# EAGLE design breakout (EAGLE 7.7.0)

## Sheet 1 of 2
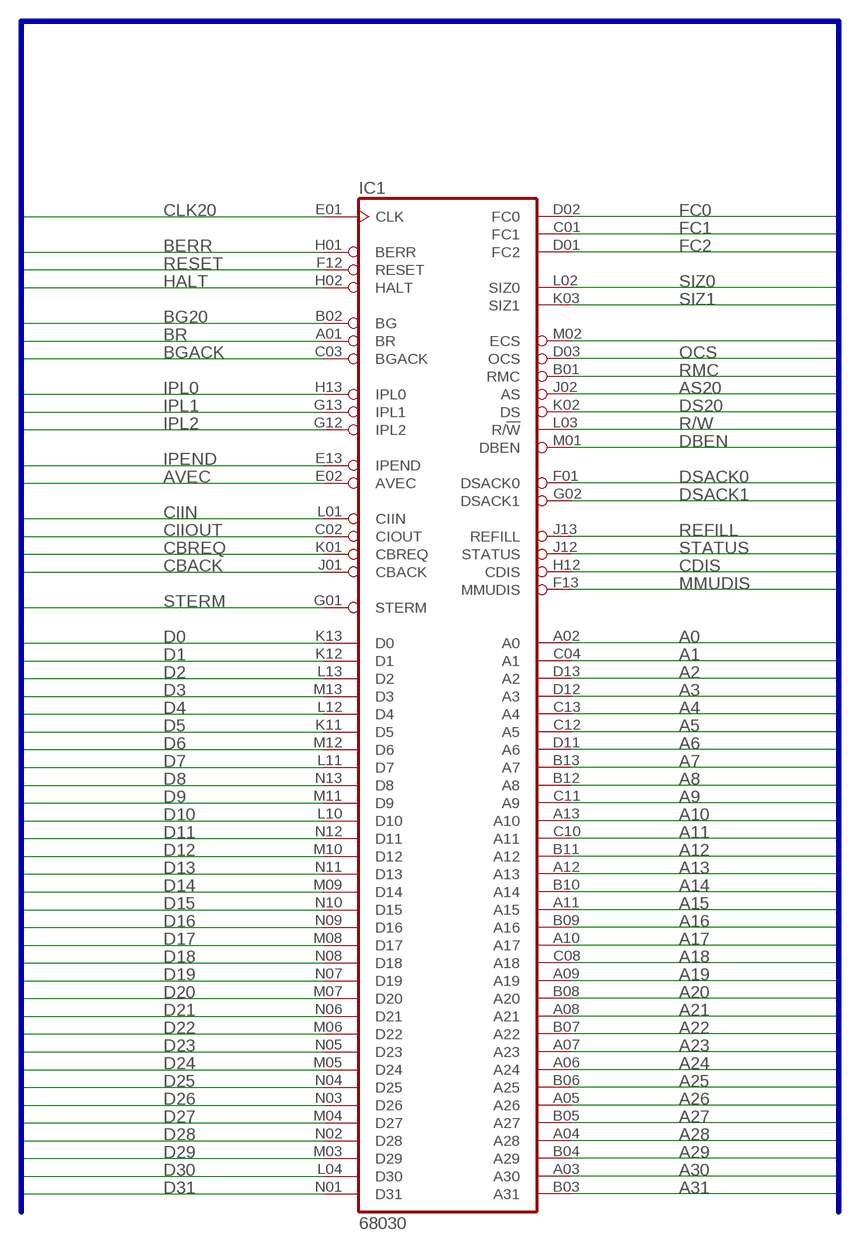
[diagram p0: schematic, sheet 1]

### Parts
IC1  68030  MC68030RC  [MPGA128]

### Nets
A0: IC1.A02(A0) ; also sheet 2
A1: IC1.C04(A1) ; also sheet 2
A2: IC1.D13(A2) ; also sheet 2
A3: IC1.D12(A3) ; also sheet 2
A4: IC1.C13(A4) ; also sheet 2
A5: IC1.C12(A5) ; also sheet 2
A6: IC1.D11(A6) ; also sheet 2
A7: IC1.B13(A7) ; also sheet 2
A8: IC1.B12(A8) ; also sheet 2
A9: IC1.C11(A9) ; also sheet 2
A10: IC1.A13(A10) ; also sheet 2
A11: IC1.C10(A11) ; also sheet 2
A12: IC1.B11(A12) ; also sheet 2
A13: IC1.A12(A13) ; also sheet 2
A14: IC1.B10(A14) ; also sheet 2
A15: IC1.A11(A15) ; also sheet 2
A16: IC1.B09(A16) ; also sheet 2
A17: IC1.A10(A17) ; also sheet 2
A18: IC1.C08(A18) ; also sheet 2
A19: IC1.A09(A19) ; also sheet 2
A20: IC1.B08(A20) ; also sheet 2
A21: IC1.A08(A21) ; also sheet 2
A22: IC1.B07(A22) ; also sheet 2
A23: IC1.A07(A23) ; also sheet 2
A24: IC1.A06(A24) ; also sheet 2
A25: IC1.B06(A25) ; also sheet 2
A26: IC1.A05(A26) ; also sheet 2
A27: IC1.B05(A27) ; also sheet 2
A28: IC1.A04(A28) ; also sheet 2
A29: IC1.B04(A29) ; also sheet 2
A30: IC1.A03(A30) ; also sheet 2
A31: IC1.B03(A31) ; also sheet 2
AS20: IC1.J02(AS) ; also sheet 2
AVEC: IC1.E02(AVEC) ; also sheet 2
BERR: IC1.H01(BERR) ; also sheet 2
BG20: IC1.B02(BG) ; also sheet 2
BGACK: IC1.C03(BGACK) ; also sheet 2
BR: IC1.A01(BR) ; also sheet 2
CBACK: IC1.J01(CBACK) ; also sheet 2
CBREQ: IC1.K01(CBREQ) ; also sheet 2
CDIS: IC1.H12(CDIS) ; also sheet 2
CIIN: IC1.L01(CIIN) ; also sheet 2
CIIOUT: IC1.C02(CIOUT) ; also sheet 2
CLK20: IC1.E01(CLK) ; also sheet 2
D0: IC1.K13(D0) ; also sheet 2
D1: IC1.K12(D1) ; also sheet 2
D2: IC1.L13(D2) ; also sheet 2
D3: IC1.M13(D3) ; also sheet 2
D4: IC1.L12(D4) ; also sheet 2
D5: IC1.K11(D5) ; also sheet 2
D6: IC1.M12(D6) ; also sheet 2
D7: IC1.L11(D7) ; also sheet 2
D8: IC1.N13(D8) ; also sheet 2
D9: IC1.M11(D9) ; also sheet 2
D10: IC1.L10(D10) ; also sheet 2
D11: IC1.N12(D11) ; also sheet 2
D12: IC1.M10(D12) ; also sheet 2
D13: IC1.N11(D13) ; also sheet 2
D14: IC1.M09(D14) ; also sheet 2
D15: IC1.N10(D15) ; also sheet 2
D16: IC1.N09(D16) ; also sheet 2
D17: IC1.M08(D17) ; also sheet 2
D18: IC1.N08(D18) ; also sheet 2
D19: IC1.N07(D19) ; also sheet 2
D20: IC1.M07(D20) ; also sheet 2
D21: IC1.N06(D21) ; also sheet 2
D22: IC1.M06(D22) ; also sheet 2
D23: IC1.N05(D23) ; also sheet 2
D24: IC1.M05(D24) ; also sheet 2
D25: IC1.N04(D25) ; also sheet 2
D26: IC1.N03(D26) ; also sheet 2
D27: IC1.M04(D27) ; also sheet 2
D28: IC1.N02(D28) ; also sheet 2
D29: IC1.M03(D29) ; also sheet 2
D30: IC1.L04(D30) ; also sheet 2
D31: IC1.N01(D31) ; also sheet 2
DBEN: IC1.M01(DBEN) ; also sheet 2
DS20: IC1.K02(DS) ; also sheet 2
DSACK0: IC1.F01(DSACK0) ; also sheet 2
DSACK1: IC1.G02(DSACK1) ; also sheet 2
ECS: IC1.M02(ECS) ; also sheet 2
FC0: IC1.D02(FC0) ; also sheet 2
FC1: IC1.C01(FC1) ; also sheet 2
FC2: IC1.D01(FC2) ; also sheet 2
HALT: IC1.H02(HALT) ; also sheet 2
IPEND: IC1.E13(IPEND) ; also sheet 2
IPL0: IC1.H13(IPL0) ; also sheet 2
IPL1: IC1.G13(IPL1) ; also sheet 2
IPL2: IC1.G12(IPL2) ; also sheet 2
MMUDIS: IC1.F13(MMUDIS) ; also sheet 2
OCS: IC1.D03(OCS) ; also sheet 2
R/W: IC1.L03(R/!W) ; also sheet 2
REFILL: IC1.J13(REFILL) ; also sheet 2
RESET: IC1.F12(RESET) ; also sheet 2
RMC: IC1.B01(RMC) ; also sheet 2
SIZ0: IC1.L02(SIZ0) ; also sheet 2
SIZ1: IC1.K03(SIZ1) ; also sheet 2
STATUS: IC1.J12(STATUS) ; also sheet 2
STERM: IC1.G01(STERM) ; also sheet 2

### Buses
VCC33,VCC,GND,CLK7M,A[0..31],D[0..31],IPL[0..2],FC[0..2],DSACK[0..1],BR,BGACK,R/W,CLK20,AS20,DS20,BG20,AVEC,SIZ[0..1],DBEN,BERR,RESET,HALT,BG,VPA,VMA,E,AS,UDS,LDS,DTACK,ECS,OCS,RMC,IPEND,CDIS,CIIN,CIIOUT,CBACK,CBREQ,MMUDIS,STATUS,REFILL,STERM

## Sheet 2 of 2
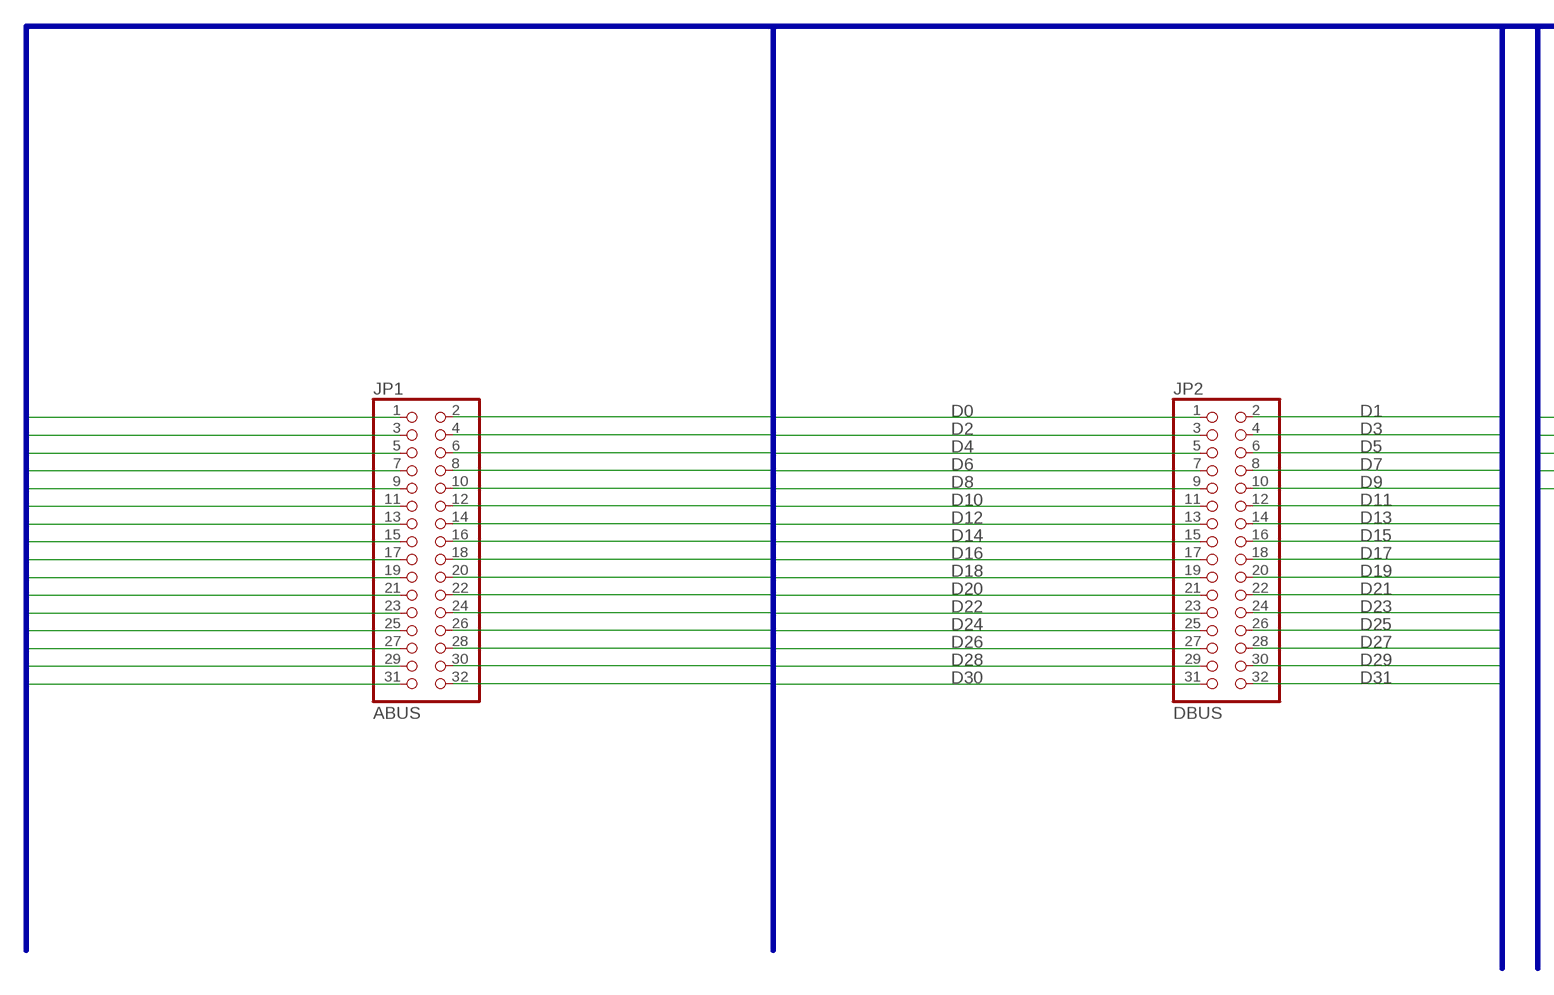
[diagram p1: schematic, sheet 2, part 1 of 2]
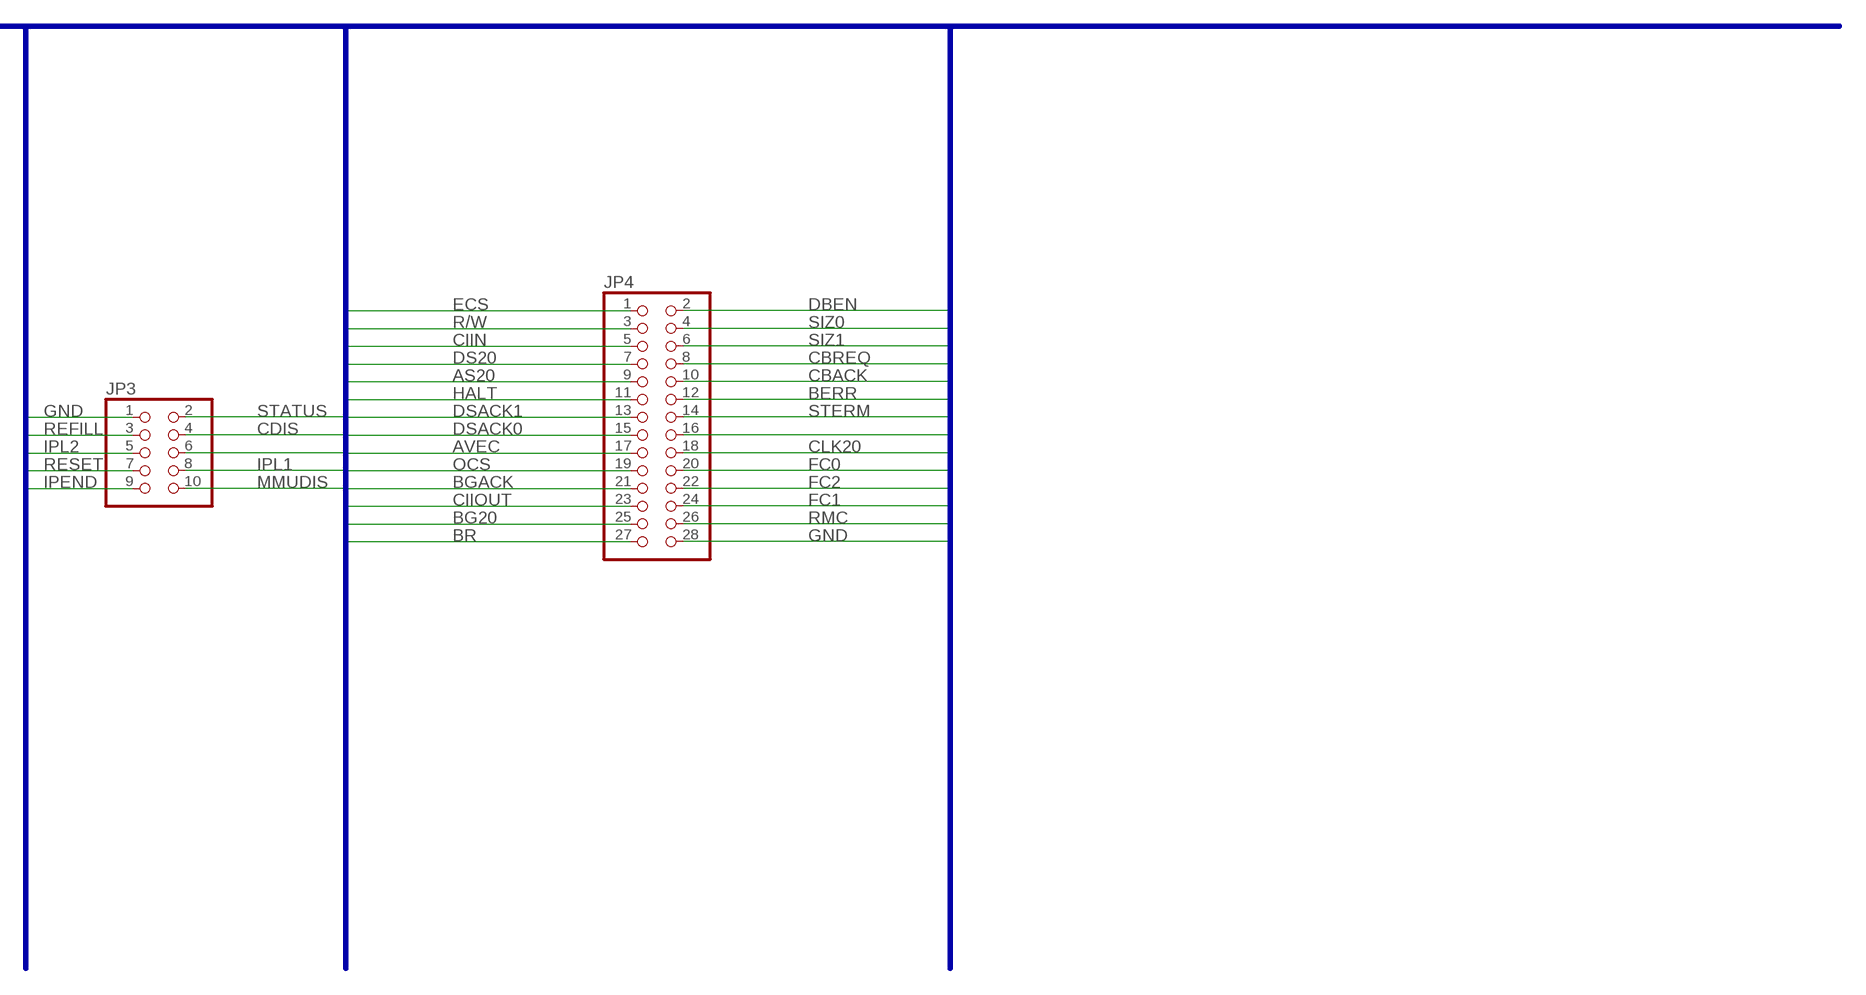
[diagram p2: schematic, sheet 2, part 2 of 2]

### Parts
JP1  ABUS  PINHD-2X16  [2X16]
JP2  DBUS  PINHD-2X16  [2X16]
JP3  PINHD-2X5  [2X05]
JP4  PINHD-2X14  [2X14]

### Nets
A0: JP1.1 ; also sheet 1
A1: JP1.2 ; also sheet 1
A2: JP1.3 ; also sheet 1
A3: JP1.4 ; also sheet 1
A4: JP1.5 ; also sheet 1
A5: JP1.6 ; also sheet 1
A6: JP1.7 ; also sheet 1
A7: JP1.8 ; also sheet 1
A8: JP1.9 ; also sheet 1
A9: JP1.10 ; also sheet 1
A10: JP1.11 ; also sheet 1
A11: JP1.12 ; also sheet 1
A12: JP1.13 ; also sheet 1
A13: JP1.14 ; also sheet 1
A14: JP1.15 ; also sheet 1
A15: JP1.16 ; also sheet 1
A16: JP1.17 ; also sheet 1
A17: JP1.18 ; also sheet 1
A18: JP1.19 ; also sheet 1
A19: JP1.20 ; also sheet 1
A20: JP1.21 ; also sheet 1
A21: JP1.22 ; also sheet 1
A22: JP1.23 ; also sheet 1
A23: JP1.24 ; also sheet 1
A24: JP1.25 ; also sheet 1
A25: JP1.26 ; also sheet 1
A26: JP1.27 ; also sheet 1
A27: JP1.28 ; also sheet 1
A28: JP1.29 ; also sheet 1
A29: JP1.30 ; also sheet 1
A30: JP1.31 ; also sheet 1
A31: JP1.32 ; also sheet 1
AS20: JP4.9 ; also sheet 1
AVEC: JP4.17 ; also sheet 1
BERR: JP4.12 ; also sheet 1
BG20: JP4.25 ; also sheet 1
BGACK: JP4.21 ; also sheet 1
BR: JP4.27 ; also sheet 1
CBACK: JP4.10 ; also sheet 1
CBREQ: JP4.8 ; also sheet 1
CDIS: JP3.4 ; also sheet 1
CIIN: JP4.5 ; also sheet 1
CIIOUT: JP4.23 ; also sheet 1
CLK20: JP4.18 ; also sheet 1
D0: JP2.1 ; also sheet 1
D1: JP2.2 ; also sheet 1
D2: JP2.3 ; also sheet 1
D3: JP2.4 ; also sheet 1
D4: JP2.5 ; also sheet 1
D5: JP2.6 ; also sheet 1
D6: JP2.7 ; also sheet 1
D7: JP2.8 ; also sheet 1
D8: JP2.9 ; also sheet 1
D9: JP2.10 ; also sheet 1
D10: JP2.11 ; also sheet 1
D11: JP2.12 ; also sheet 1
D12: JP2.13 ; also sheet 1
D13: JP2.14 ; also sheet 1
D14: JP2.15 ; also sheet 1
D15: JP2.16 ; also sheet 1
D16: JP2.17 ; also sheet 1
D17: JP2.18 ; also sheet 1
D18: JP2.19 ; also sheet 1
D19: JP2.20 ; also sheet 1
D20: JP2.21 ; also sheet 1
D21: JP2.22 ; also sheet 1
D22: JP2.23 ; also sheet 1
D23: JP2.24 ; also sheet 1
D24: JP2.25 ; also sheet 1
D25: JP2.26 ; also sheet 1
D26: JP2.27 ; also sheet 1
D27: JP2.28 ; also sheet 1
D28: JP2.29 ; also sheet 1
D29: JP2.30 ; also sheet 1
D30: JP2.31 ; also sheet 1
D31: JP2.32 ; also sheet 1
DBEN: JP4.2 ; also sheet 1
DS20: JP4.7 ; also sheet 1
DSACK0: JP4.15 ; also sheet 1
DSACK1: JP4.13 ; also sheet 1
ECS: JP4.1 ; also sheet 1
FC0: JP4.20 ; also sheet 1
FC1: JP4.24 ; also sheet 1
FC2: JP4.22 ; also sheet 1
GND: JP3.1 JP4.28
HALT: JP4.11 ; also sheet 1
IPEND: JP3.9 ; also sheet 1
IPL0: JP3.6 ; also sheet 1
IPL1: JP3.8 ; also sheet 1
IPL2: JP3.5 ; also sheet 1
MMUDIS: JP3.10 ; also sheet 1
OCS: JP4.19 ; also sheet 1
R/W: JP4.3 ; also sheet 1
REFILL: JP3.3 ; also sheet 1
RESET: JP3.7 ; also sheet 1
RMC: JP4.26 ; also sheet 1
SIZ0: JP4.4 ; also sheet 1
SIZ1: JP4.6 ; also sheet 1
STATUS: JP3.2 ; also sheet 1
STERM: JP4.14 ; also sheet 1
VCC: JP4.16

### Buses
VCC33,VCC,GND,CLK7M,A[0..31],D[0..31],IPL[0..2],FC[0..2],DSACK[0..1],BR,BGACK,R/W,CLK20,AS20,DS20,BG20,AVEC,SIZ[0..1],DBEN,BERR,RESET,HALT,BG,VPA,VMA,E,AS,UDS,LDS,DTACK,ECS,OCS,RMC,IPEND,CDIS,CIIN,CIIOUT,CBACK,CBREQ,MMUDIS,STATUS,REFILL,STERM

## Power pins joined to a net without a drawn wire
GND: IC1.C05(GND) IC1.C07(GND) IC1.C09(GND) IC1.E03(GND) IC1.E11(GND) IC1.F03(GND) IC1.G03(GND) IC1.G11(GND) IC1.J03(GND) IC1.J11(GND) IC1.L05(GND) IC1.L07(GND) IC1.L08(GND) IC1.L09(GND)
VCC: IC1.C06(VCC) IC1.D04(VCC) IC1.D10(VCC) IC1.F02(VCC) IC1.F11(VCC) IC1.H03(VCC) IC1.H11(VCC) IC1.K04(VCC) IC1.K10(VCC) IC1.L06(VCC)

## Library data of the parts
IC1 = micro-mc68000:MC68030RC: 68xxx PROCESSOR; MF: MOTOROLA; MPN: MC68030RC50C; OC_FARNELL: unknown; OC_NEWARK: 52F3269
JP1 JP2 = pinhead:PINHD-2X16: PIN HEADER
JP3 = pinhead:PINHD-2X5: PIN HEADER
JP4 = pinhead:PINHD-2X14: PIN HEADER

## Board
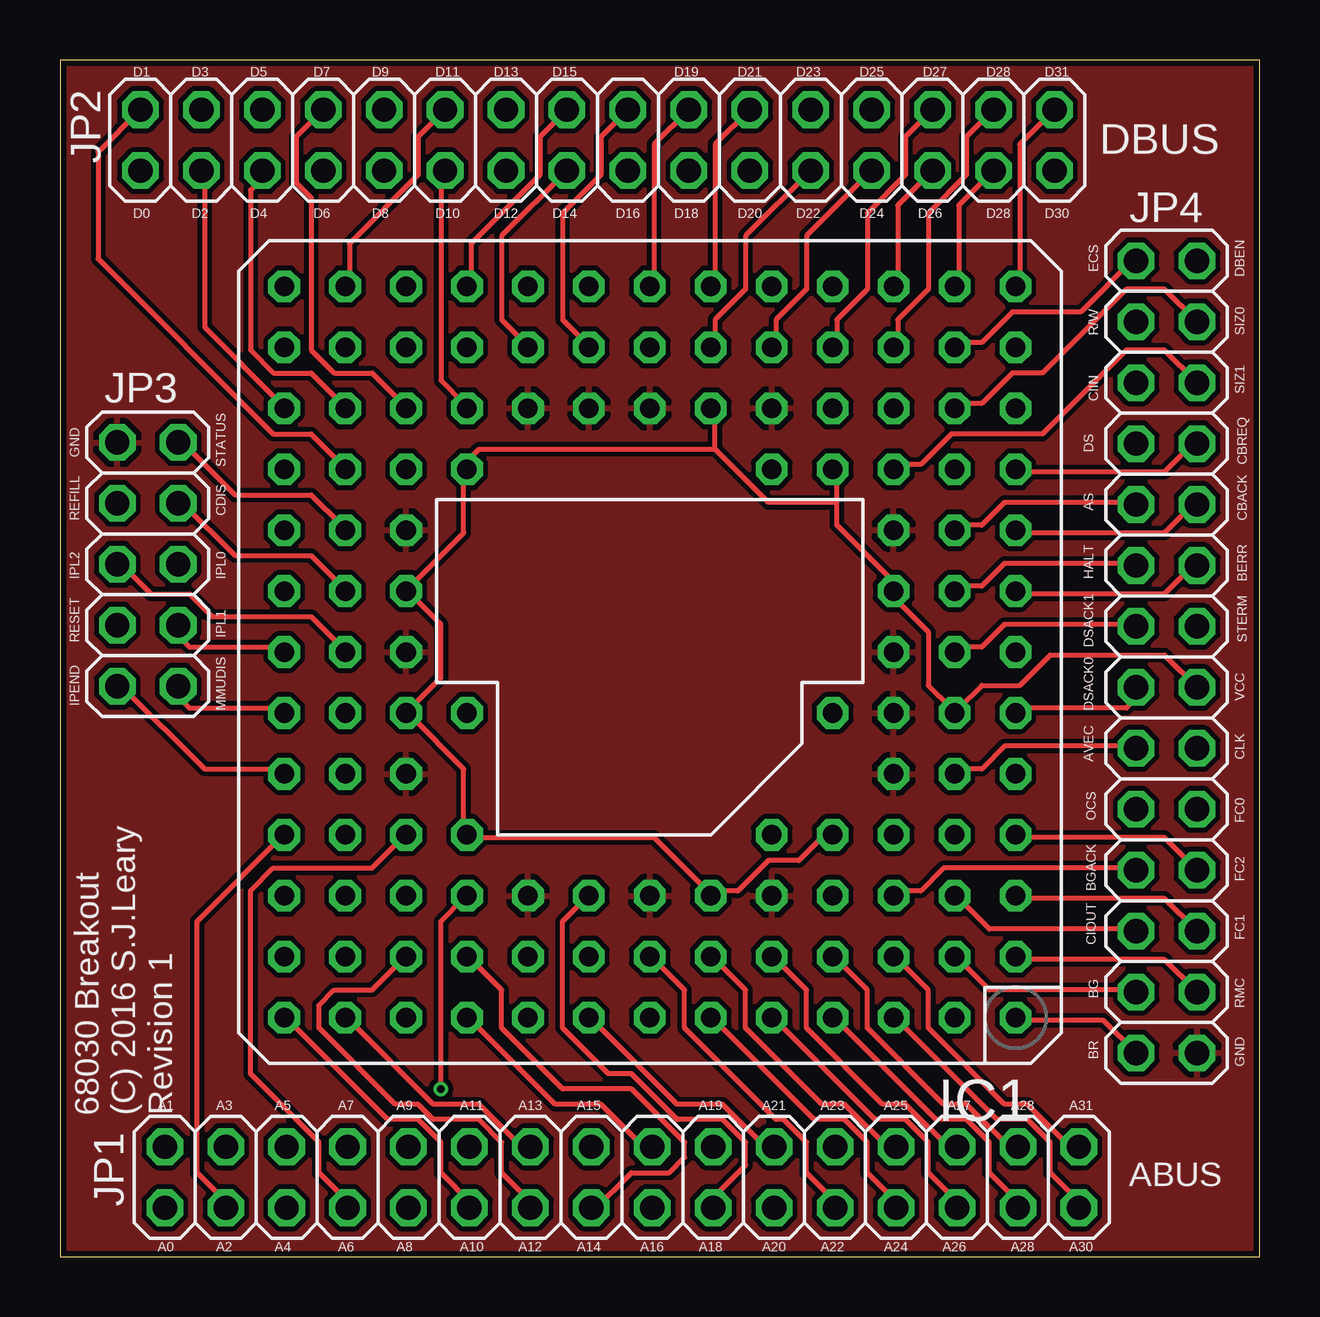
[diagram p3: board, top side]
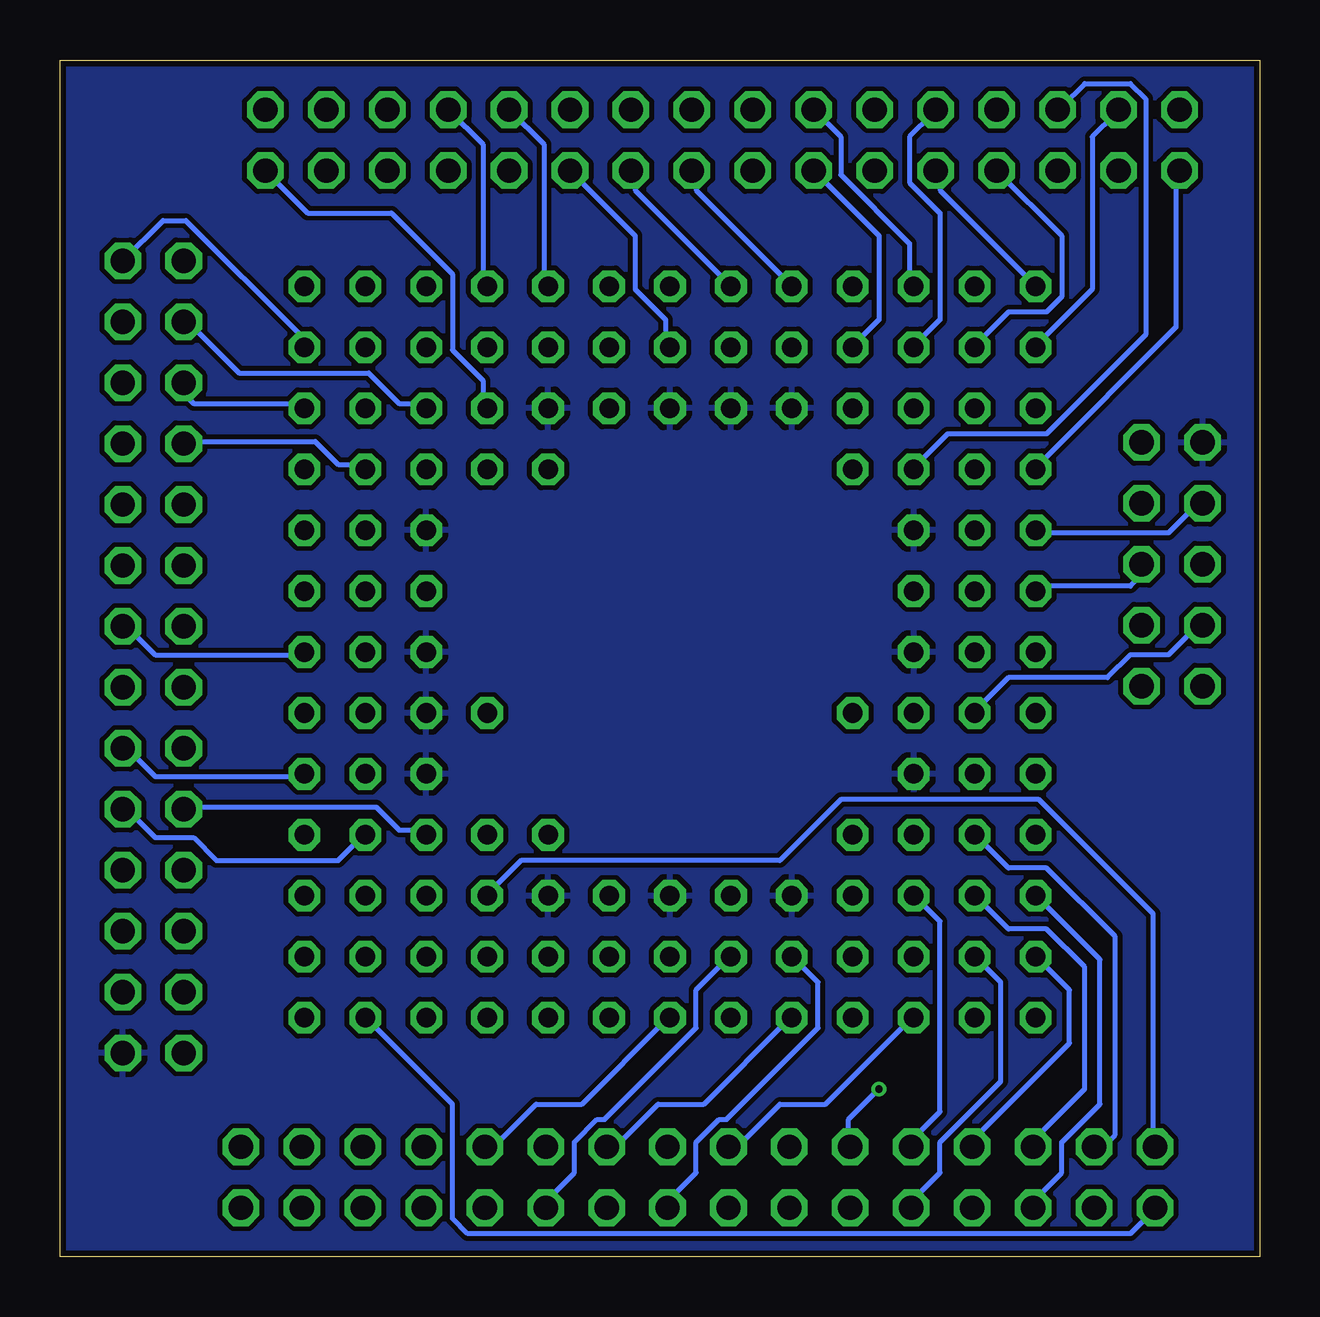
[diagram p4: board, bottom side, seen from below]

Size 50.01 x 49.88 mm. Coordinates in mm from the lower left corner, seen from the top.
Outline: 0,0 50.01,0 50.01,49.88 0,49.88 0,0
Copper layers (1*16): Top 0.035mm / dielectric 1.5mm / Bottom 0.035mm
Design rules "dirt_cheap_dirty_boards.v1 *": minimum track width 8mil, minimum drill 12mil, track to track 8mil, track to pad 8mil, pad to pad 8mil, via to via 8mil, smd to smd 0mil, copper to edge 10mil, drill to drill 10mil, minimum pad ring 10mil, minimum via ring 6mil, stop-mask expansion 2mil, vias tented up to drill 25mil, thermal gap 10mil

### Footprints (pad centres in the part's own frame; a part is rotated, then mirrored left to right if it is on the bottom)
MPGA128 = drill 0.813 octagon: A01 -15.24,15.24; A02 -12.7,15.24; A03 -10.16,15.24; A04 -7.62,15.24; A05 -5.08,15.24; A06 -2.54,15.24; A07 0,15.24; A08 2.54,15.24; A09 5.08,15.24; A10 7.62,15.24; A11 10.16,15.24; A12 12.7,15.24; A13 15.24,15.24; B01 -15.24,12.7; B02 -12.7,12.7; B03 -10.16,12.7; B04 -7.62,12.7; B05 -5.08,12.7; B06 -2.54,12.7; B07 0,12.7; B08 2.54,12.7; B09 5.08,12.7; B10 7.62,12.7; B11 10.16,12.7; B12 12.7,12.7; B13 15.24,12.7; C01 -15.24,10.16; C02 -12.7,10.16; C03 -10.16,10.16; C04 -7.62,10.16; C05 -5.08,10.16; C06 -2.54,10.16; C07 0,10.16; C08 2.54,10.16; C09 5.08,10.16; C10 7.62,10.16; C11 10.16,10.16; C12 12.7,10.16; C13 15.24,10.16; D01 -15.24,7.62; D02 -12.7,7.62; D03 -10.16,7.62; D04 -7.62,7.62; D05 -5.08,7.62; D10 7.62,7.62; D11 10.16,7.62; D12 12.7,7.62; D13 15.24,7.62; E01 -15.24,5.08; E02 -12.7,5.08; E03 -10.16,5.08; E11 10.16,5.08; E12 12.7,5.08; E13 15.24,5.08; F01 -15.24,2.54; F02 -12.7,2.54; F03 -10.16,2.54; F04 -7.62,2.54; F10 7.62,2.54; F11 10.16,2.54; F12 12.7,2.54; F13 15.24,2.54; G01 -15.24,0; G02 -12.7,0; G03 -10.16,0; G11 10.16,0; G12 12.7,0; G13 15.24,0; H01 -15.24,-2.54; H02 -12.7,-2.54; H03 -10.16,-2.54; H11 10.16,-2.54; H12 12.7,-2.54; H13 15.24,-2.54; J01 -15.24,-5.08; J02 -12.7,-5.08; J03 -10.16,-5.08; J11 10.16,-5.08; J12 12.7,-5.08; J13 15.24,-5.08; K01 -15.24,-7.62; K02 -12.7,-7.62; K03 -10.16,-7.62; K04 -7.62,-7.62; K05 -5.08,-7.62; K10 7.62,-7.62; K11 10.16,-7.62; K12 12.7,-7.62; K13 15.24,-7.62; L01 -15.24,-10.16; L02 -12.7,-10.16; L03 -10.16,-10.16; L04 -7.62,-10.16; L05 -5.08,-10.16; L06 -2.54,-10.16; L07 0,-10.16; L08 2.54,-10.16; L09 5.08,-10.16; L10 7.62,-10.16; L11 10.16,-10.16; L12 12.7,-10.16; L13 15.24,-10.16; M01 -15.24,-12.7; M02 -12.7,-12.7; M03 -10.16,-12.7; M04 -7.62,-12.7; M05 -5.08,-12.7; M06 -2.54,-12.7; M07 0,-12.7; M08 2.54,-12.7; M09 5.08,-12.7; M10 7.62,-12.7; M11 10.16,-12.7; M12 12.7,-12.7; M13 15.24,-12.7; N01 -15.24,-15.24; N02 -12.7,-15.24; N03 -10.16,-15.24; N04 -7.62,-15.24; N05 -5.08,-15.24; N06 -2.54,-15.24; N07 0,-15.24; N08 2.54,-15.24; N09 5.08,-15.24; N10 7.62,-15.24; N11 10.16,-15.24; N12 12.7,-15.24; N13 15.24,-15.24
2X16 = drill 1.016 octagon: 1 -19.05,-1.27; 2 -19.05,1.27; 3 -16.51,-1.27; 4 -16.51,1.27; 5 -13.97,-1.27; 6 -13.97,1.27; 7 -11.43,-1.27; 8 -11.43,1.27; 9 -8.89,-1.27; 10 -8.89,1.27; 11 -6.35,-1.27; 12 -6.35,1.27; 13 -3.81,-1.27; 14 -3.81,1.27; 15 -1.27,-1.27; 16 -1.27,1.27; 17 1.27,-1.27; 18 1.27,1.27; 19 3.81,-1.27; 20 3.81,1.27; 21 6.35,-1.27; 22 6.35,1.27; 23 8.89,-1.27; 24 8.89,1.27; 25 11.43,-1.27; 26 11.43,1.27; 27 13.97,-1.27; 28 13.97,1.27; 29 16.51,-1.27; 30 16.51,1.27; 31 19.05,-1.27; 32 19.05,1.27
2X05 = drill 1.016 octagon: 1 -5.08,-1.27; 2 -5.08,1.27; 3 -2.54,-1.27; 4 -2.54,1.27; 5 0,-1.27; 6 0,1.27; 7 2.54,-1.27; 8 2.54,1.27; 9 5.08,-1.27; 10 5.08,1.27
2X14 = drill 1.016 octagon: 1 -16.51,-1.27; 2 -16.51,1.27; 3 -13.97,-1.27; 4 -13.97,1.27; 5 -11.43,-1.27; 6 -11.43,1.27; 7 -8.89,-1.27; 8 -8.89,1.27; 9 -6.35,-1.27; 10 -6.35,1.27; 11 -3.81,-1.27; 12 -3.81,1.27; 13 -1.27,-1.27; 14 -1.27,1.27; 15 1.27,-1.27; 16 1.27,1.27; 17 3.81,-1.27; 18 3.81,1.27; 19 6.35,-1.27; 20 6.35,1.27; 21 8.89,-1.27; 22 8.89,1.27; 23 11.43,-1.27; 24 11.43,1.27; 25 13.97,-1.27; 26 13.97,1.27; 27 16.51,-1.27; 28 16.51,1.27

### Placement (x,y rotation side)
IC1  24.59,25.2 180 top
JP1  23.42,3.3 0 top
JP2  22.4,46.53 0 top
JP3  3.66,28.85 270 top
JP4  46.13,24.99 270 top

### Tracks (layer width: path | path; a pad name or v marks a point on that pad's centre or on a via)
A0
  Bottom 0.203: IC1.A02 37.15,9.84 33.66,6.35 33.66,1.59 33.02,0.95 5.4,0.95 4.45,1.91 JP1.1
A1
  Bottom 0.203: IC1.C04 32.07,15.24 30.8,16.51 20,16.51 17.46,19.05 9.21,19.05 4.45,14.29 4.45,4.76 JP1.2
A2
  Top 0.203: IC1.D13 9.21,17.46 5.71,13.97 5.71,3.49 6.99,2.22 JP1.3
A3
  Bottom 0.203: IC1.D12 11.75,17.46 10.48,16.19 8.89,16.19 6.03,13.34 6.03,5.08 6.67,4.45 JP1.4
A4
  Bottom 0.203: IC1.C13 9.21,14.92 6.67,12.38 6.67,6.35 8.26,4.76 8.26,3.49 9.53,2.22 JP1.5
A5
  Bottom 0.203: IC1.C12 11.75,14.92 10.48,13.65 8.89,13.65 7.3,12.06 7.3,6.99 9.53,4.76 JP1.6
A6
  Top 0.203: IC1.D11 14.29,17.46 13.02,16.19 8.89,16.19 7.94,15.24 7.94,7.62 10.79,4.76 10.79,3.49 12.06,2.22 JP1.7
A7
  Bottom 0.203: IC1.B13 9.21,12.38 7.94,11.11 7.94,8.89 12.06,4.76 JP1.8
A8
  Bottom 0.203: IC1.B12 11.75,12.38 10.79,11.43 10.79,7.3 13.34,4.76 13.34,3.49 14.61,2.22 JP1.9
A9
  Bottom 0.203: IC1.C11 14.29,14.92 13.34,13.97 13.34,6.03 14.61,4.76 JP1.10
A10
  Top 0.203: IC1.A13 9.53,9.84 13.65,5.71 14.92,5.71 15.88,4.76 15.88,3.49 17.14,2.22 JP1.11
A11  (via drill 0.3)
  Top 0.203: v15.88,6.99 15.88,13.97 16.83,14.92 IC1.C10
  Bottom 0.203: v15.88,6.99 17.14,5.71 17.14,4.76 JP1.12
A12
  Top 0.203: IC1.B11 14.29,12.38 13.02,11.11 11.43,11.11 10.79,10.48 10.79,9.53 13.97,6.35 14.92,6.35 15.56,5.71 17.46,5.71 18.41,4.76 18.41,3.49 19.68,2.22 JP1.13
A13
  Top 0.203: IC1.A12 12.06,9.84 15.56,6.35 17.46,6.35 19.37,4.45 JP1.14
A14
  Top 0.203: IC1.B10 17.14,12.38 18.41,11.11 18.41,9.53 20.95,6.99 23.81,6.99 26.04,4.76 26.04,4.13 25.4,3.49 23.81,3.49 22.23,1.91 JP1.15
A15
  Bottom 0.203: IC1.A11 14.61,9.84 18.1,6.35 20,6.35 21.91,4.45 JP1.16
A16
  Bottom 0.203: IC1.B09 19.37,12.38 18.41,11.43 18.41,9.53 22.23,5.71 22.54,5.71 23.5,4.76 23.5,3.49 24.77,2.22 JP1.17
A17
  Top 0.203: IC1.A10 17.14,9.84 20.64,6.35 22.54,6.35 24.45,4.45 JP1.18
A18
  Top 0.203: IC1.C08 21.91,14.92 20.95,13.97 20.95,9.53 22.86,7.62 23.81,7.62 25.72,5.71 27.62,5.71 28.57,4.76 28.57,3.81 26.99,2.22 JP1.19
A19
  Bottom 0.203: IC1.A09 19.68,9.84 23.18,6.35 25.08,6.35 26.99,4.45 JP1.20
A20
  Bottom 0.203: IC1.B08 22.23,12.38 23.5,11.11 23.5,9.53 27.3,5.71 27.62,5.71 28.57,4.76 28.57,3.49 29.84,2.22 JP1.21
A21
  Top 0.203: IC1.A08 22.23,9.84 25.72,6.35 27.62,6.35 29.53,4.45 JP1.22
A22
  Top 0.203: IC1.B07 24.77,12.38 26.04,11.11 26.04,9.53 29.84,5.71 30.16,5.71 31.11,4.76 31.11,3.49 32.38,2.22 JP1.23
A23
  Bottom 0.203: IC1.A07 24.77,9.84 28.26,6.35 30.16,6.35 32.07,4.45 JP1.24
A24
  Top 0.203: IC1.A06 27.3,9.84 31.43,5.71 32.7,5.71 33.66,4.76 33.66,3.49 34.92,2.22 JP1.25
A25
  Top 0.203: IC1.B06 27.3,12.38 28.57,11.11 28.57,9.53 31.75,6.35 32.7,6.35 34.61,4.45 JP1.26
A26
  Top 0.203: IC1.A05 29.84,9.84 33.97,5.71 35.24,5.71 36.2,4.76 36.2,3.49 37.47,2.22 JP1.27
A27
  Top 0.203: IC1.B05 29.84,12.38 31.11,11.11 31.11,9.53 34.29,6.35 35.24,6.35 37.15,4.45 JP1.28
A28
  Top 0.203: IC1.A04 32.38,9.84 36.51,5.71 37.78,5.71 38.73,4.76 38.73,3.49 40.01,2.22 JP1.29
A29
  Top 0.203: IC1.B04 32.38,12.38 33.66,11.11 33.66,9.53 36.83,6.35 37.78,6.35 39.69,4.45 JP1.30
A30
  Top 0.203: IC1.A03 34.92,9.84 39.05,5.71 40.32,5.71 41.27,4.76 41.27,3.49 42.55,2.22 JP1.31
A31
  Top 0.203: IC1.B03 34.92,12.38 36.2,11.11 36.2,9.53 39.37,6.35 40.32,6.35 42.23,4.45 JP1.32
AS20
  Top 0.203: IC1.J02 37.47,30.48 38.42,30.48 39.37,31.43 44.77,31.43 JP4.9
AVEC
  Top 0.203: IC1.E02 37.47,20.32 38.42,20.32 39.37,21.27 44.77,21.27 JP4.17
BERR
  Top 0.203: IC1.H01 40.01,27.62 46.04,27.62 47.31,28.89 JP4.12
BG20
  Top 0.203: IC1.B02 37.47,12.38 38.73,11.11 44.77,11.11 JP4.25
BGACK
  Top 0.203: IC1.C03 34.92,15.24 35.88,15.24 36.83,16.19 44.77,16.19 JP4.21
BR
  Top 0.203: JP4.27 43.5,9.84 40.01,9.84 IC1.A01
CBACK
  Top 0.203: IC1.J01 40.01,30.16 46.04,30.16 47.31,31.43 JP4.10
CBREQ
  Top 0.203: IC1.K01 40.01,32.7 46.04,32.7 47.31,33.97 JP4.8
CDIS
  Top 0.203: IC1.H12 11.75,27.94 10.48,29.21 7.3,29.21 5.08,31.43 JP3.4
CIIN
  Bottom 0.203: IC1.L01 40.01,35.56 44.45,35.56 45.09,36.2 JP4.5
CIIOUT
  Top 0.203: IC1.C02 37.47,14.92 38.73,13.65 44.77,13.65 JP4.23
CLK20
  Bottom 0.203: IC1.E01 40.01,20 46.04,20 47.31,21.27 JP4.18
D0
  Bottom 0.203: IC1.K13 9.21,33.02 3.49,38.73 3.49,45.09 JP2.1
D1
  Top 0.203: JP2.2 1.59,46.04 1.59,41.59 8.89,34.29 10.48,34.29 11.75,33.02 IC1.K12
D2
  Top 0.203: IC1.L13 9.21,35.56 6.03,38.73 6.03,45.09 JP2.3
D3
  Bottom 0.203: IC1.M13 9.21,38.1 6.99,40.32 6.99,46.67 6.03,47.62 JP2.4
D4
  Top 0.203: IC1.L12 11.75,35.56 10.48,36.83 8.89,36.83 7.94,37.78 7.94,44.45 8.57,45.09 JP2.5
D5
  Bottom 0.203: IC1.K11 14.29,33.02 13.02,34.29 8.89,34.29 4.76,38.42 4.76,48.26 5.4,48.9 7.3,48.9 8.26,47.94 JP2.6
D6
  Bottom 0.203: JP2.7 8.26,42.55 8.26,40.01 8.89,39.37 10.48,39.37 11.75,38.1 IC1.M12
D7
  Top 0.203: JP2.8 9.84,46.67 9.84,44.77 10.48,44.13 10.48,37.78 11.43,36.83 13.02,36.83 14.29,35.56 IC1.L11
D8
  Bottom 0.203: IC1.N13 9.53,40.64 13.34,44.45 13.34,45.09 JP2.9
D9
  Bottom 0.203: IC1.M11 14.29,38.1 13.34,39.05 13.34,43.5 14.61,44.77 14.61,46.67 13.65,47.62 JP2.10
D10
  Top 0.203: IC1.L10 16.83,35.56 15.88,36.51 15.88,45.09 JP2.11
D11
  Top 0.203: JP2.12 14.92,46.67 14.92,45.09 12.06,42.23 12.06,40.64 IC1.N12
D12
  Bottom 0.203: JP2.13 15.88,42.55 15.88,39.05 16.83,38.1 IC1.M10
D13
  Bottom 0.203: JP2.14 17.46,46.67 17.46,45.09 14.61,42.23 14.61,40.64 IC1.N11
D14
  Top 0.203: JP2.15 18.41,42.55 18.41,39.05 19.37,38.1 IC1.M09
D15
  Top 0.203: JP2.16 20,46.67 20,45.09 17.14,42.23 17.14,40.64 IC1.N10
D16
  Bottom 0.203: IC1.N09 19.68,40.64 23.5,44.45 23.5,45.09 JP2.17
D17
  Top 0.203: JP2.18 22.54,46.67 22.54,45.09 20.95,43.5 20.95,39.05 21.91,38.1 IC1.M08
D18
  Bottom 0.203: IC1.N08 22.23,40.64 26.04,44.45 26.04,45.09 JP2.19
D19
  Top 0.203: JP2.20 24.77,46.35 24.77,40.64 IC1.N07
D20
  Bottom 0.203: JP2.21 26.04,42.55 26.04,40.32 24.77,39.05 24.77,38.1 IC1.M07
D21
  Top 0.203: JP2.22 27.3,46.35 27.3,40.64 IC1.N06
D22
  Top 0.203: JP2.23 28.57,42.55 28.57,40.32 27.3,39.05 27.3,38.1 IC1.M06
D23
  Bottom 0.203: JP2.24 29.84,46.35 29.84,40.64 IC1.N05
D24
  Top 0.203: JP2.25 31.11,42.55 31.11,40.32 29.84,39.05 29.84,38.1 IC1.M05
D25
  Bottom 0.203: JP2.26 32.38,46.35 32.38,40.64 IC1.N04
D26
  Top 0.203: JP2.27 34.92,43.81 34.92,40.64 IC1.N03
D27
  Top 0.203: JP2.28 35.24,46.67 35.24,45.09 33.66,43.5 33.66,40.32 32.38,39.05 32.38,38.1 IC1.M04
D28
  Top 0.203: JP2.29 37.47,43.81 37.47,40.64 IC1.N02
D29
  Top 0.203: JP2.30 37.78,46.67 37.78,45.09 36.2,43.5 36.2,40.32 34.92,39.05 34.92,38.1 IC1.M03
D30
  Bottom 0.203: JP2.31 39.69,43.5 36.2,43.5 33.66,40.96 33.66,37.78 32.38,36.51 32.38,35.56 IC1.L04
D31
  Top 0.203: JP2.32 40.01,46.35 40.01,40.64 IC1.N01
DBEN
  Bottom 0.203: JP4.2 45.72,43.18 44.77,43.18 40.01,38.42 40.01,38.1 IC1.M01
DS20
  Bottom 0.203: IC1.K02 37.47,33.02 38.42,33.02 39.37,33.97 44.77,33.97 JP4.7
DSACK0
  Top 0.203: IC1.F01 40.01,22.86 44.45,22.86 45.09,23.5 JP4.15
DSACK1
  Top 0.203: IC1.G02 37.47,25.4 38.42,25.4 39.37,26.35 44.77,26.35 JP4.13
ECS
  Top 0.203: IC1.M02 37.47,38.1 38.42,38.1 39.69,39.37 42.55,39.37 44.77,41.59 JP4.1
FC0
  Bottom 0.203: IC1.D02 37.47,17.46 38.42,16.51 43.5,16.51 44.45,17.46 46.04,17.46 47.31,18.73 JP4.20
FC1
  Top 0.203: JP4.24 46.04,14.92 40.01,14.92 IC1.C01
FC2
  Top 0.203: JP4.22 46.04,17.46 40.01,17.46 IC1.D01
GND
  pour Bottom: 0,49.78 49.99,49.78 49.99,0 0,0
  pour Top: 0,49.78 49.99,49.78 49.99,0 0,0
HALT
  Top 0.203: IC1.H02 37.47,27.94 38.42,27.94 39.37,28.89 44.77,28.89 JP4.11
IPEND
  Top 0.203: IC1.E13 9.21,20.32 6.03,20.32 2.54,23.81 JP3.9
IPL0
  Bottom 0.203: IC1.H13 9.21,27.94 5.4,27.94 4.76,28.57 JP3.6
IPL1
  Top 0.203: IC1.G13 9.21,25.4 5.4,25.4 4.76,26.04 JP3.8
IPL2
  Top 0.203: IC1.G12 11.75,25.4 10.48,26.67 6.35,26.67 5.4,27.62 3.81,27.62 2.54,28.89 JP3.5
MMUDIS
  Top 0.203: IC1.F13 9.21,22.86 5.4,22.86 4.76,23.5 JP3.10
OCS
  Bottom 0.203: IC1.D03 34.92,17.78 35.88,17.78 36.83,18.73 44.77,18.73 JP4.19
R/W
  Bottom 0.203: IC1.L03 34.92,35.56 35.88,35.56 37.15,36.83 42.55,36.83 44.77,39.05 JP4.3
REFILL
  Bottom 0.203: IC1.J13 9.21,30.16 3.81,30.16 2.54,31.43 JP3.3
RESET
  Bottom 0.203: IC1.F12 11.75,22.86 10.48,24.13 6.35,24.13 5.4,25.08 3.81,25.08 2.54,26.35 JP3.7
RMC
  Top 0.203: JP4.26 46.04,12.38 40.01,12.38 IC1.B01
SIZ0
  Top 0.203: JP4.4 46.04,40.32 44.45,40.32 40.96,36.83 39.69,36.83 38.42,35.56 37.47,35.56 IC1.L02
SIZ1
  Top 0.203: JP4.6 46.04,37.78 44.45,37.78 40.96,34.29 37.15,34.29 35.88,33.02 34.92,33.02 IC1.K03
STATUS
  Top 0.203: IC1.J12 11.75,30.48 10.48,31.75 7.3,31.75 5.08,33.97 JP3.2
STERM
  Bottom 0.203: IC1.G01 40.01,25.08 46.04,25.08 47.31,26.35 JP4.14
VCC
  Top 0.203: 32.38,31.43 32.38,30.48 34.92,27.94 IC1.H03 34.61,27.62 36.2,26.04 36.2,23.81 37.15,22.86 IC1.F02 37.47,22.86 38.42,23.81 40.01,23.81 41.27,25.08 46.04,25.08 JP4.16 | 32.38,31.43 32.38,32.7 IC1.K04 | 27.3,33.66 27.3,35.24 IC1.L06 | 27.3,33.66 29.53,31.43 32.38,31.43 | IC1.D04 32.07,17.78 30.8,16.51 29.53,16.51 28.26,15.24 27.3,15.24 IC1.C06 26.99,15.24 24.77,17.46 17.14,17.46 IC1.D10 16.83,17.78 16.83,20.32 14.61,22.54 IC1.F11 14.61,22.86 15.88,24.13 15.88,26.35 14.61,27.62 IC1.H11 14.61,27.94 16.83,30.16 16.83,32.7 IC1.K10 16.83,33.02 17.46,33.66 27.3,33.66

### Text on the board
tNames: D1 | D3 | D5 | D7 | D9 | D11 | D13 | D15 | D19 | D21 | D23 | D25 | D27 | D28 | D31 | D0 | D2 | D4 | D6 | D8 | D10 | D12 | D14 | D16 | D18 | D20 | D22 | D24 | D26 | D28 | D30 | ECS | DBEN | R/W | SIZ0 | CIIN | SIZ1 | DS | GND | STATUS | CBREQ | REFILL | CDIS | AS | CBACK | IPL2 | IPL0 | HALT | BERR | RESET | IPL1 | STERM | DSACK1 | IPEND | MMUDIS | DSACK0 | VCC | AVEC | CLK | OCS | FC0 | FC2 | BGACK | CIOUT | FC1 | BG | RMC | BR | GND | A1 | 68030 Breakout / (C) 2016 S.J.Leary / Revision 1 | A3 | A5 | A7 | A9 | A11 | A13 | A15 | A19 | A21 | A23 | A25 | A27 | A28 | A31 | A0 | A2 | A4 | A6 | A8 | A10 | A12 | A14 | A16 | A18 | A20 | A22 | A24 | A26 | A28 | A30
tValues: D17 | A17